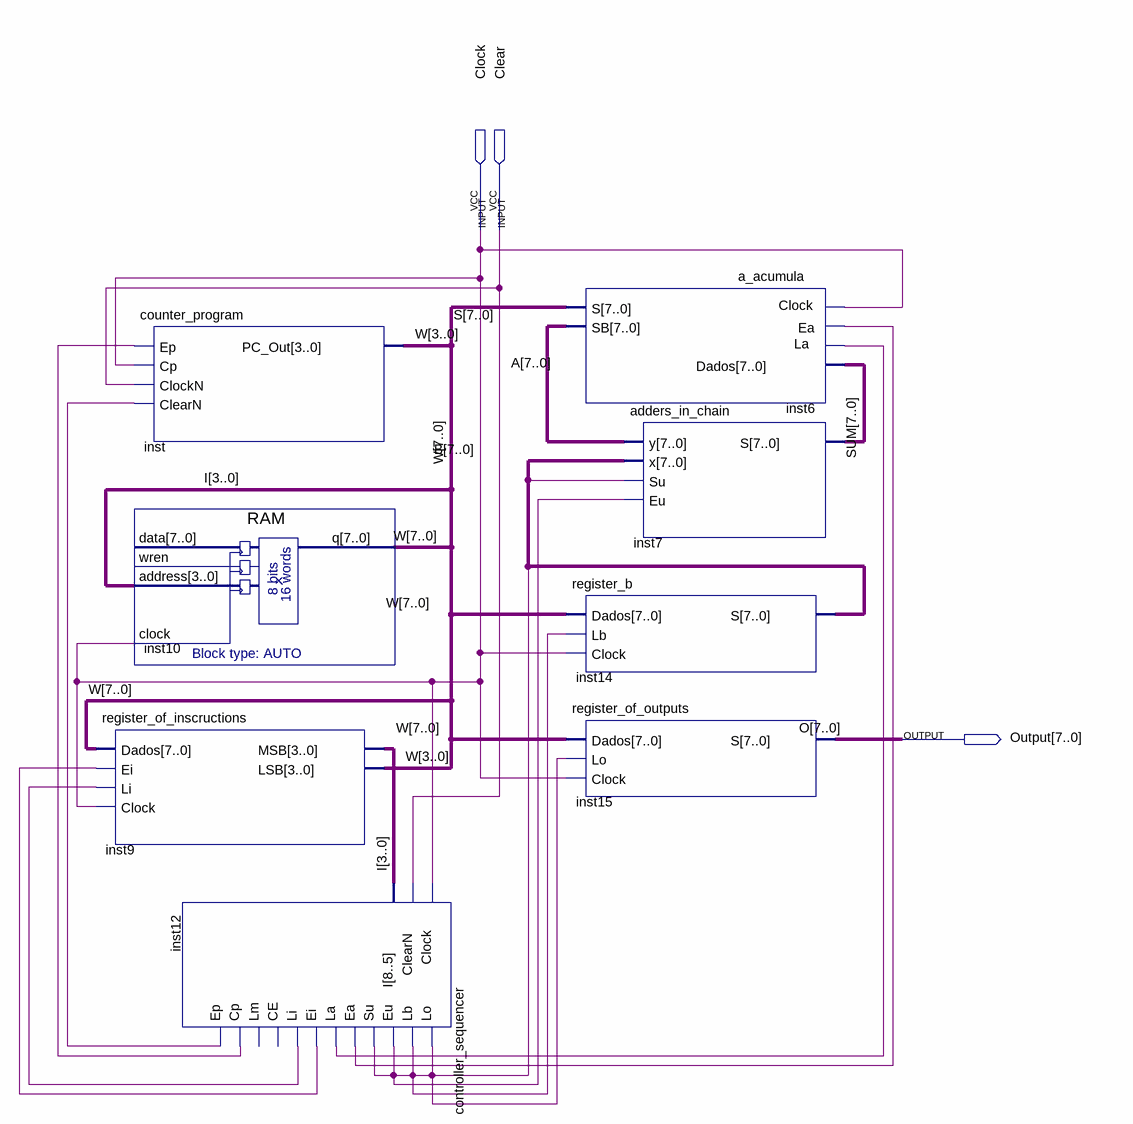
[diagram p0: schematic sheet]
// Quartus schematic m_computer.bdf as structural Verilog: 8 symbols, 3 pins
module m_computer (
  input  Clock,
  input  Clear,
  output [7:0] Output
);

  wire inst12_cp, inst12_ea, inst12_ei, inst12_ep, inst12_la, inst12_li, inst12_lo, undriven;
  wire [3:0] I;
  wire [7:0] A, B, S, SUM, W;

  counter_program inst (.Ep(inst12_cp), .Cp(Clock), .ClockN(Clear), .ClearN(inst12_ep), .PC_Out(W[3:0]));
  RAM inst10 (.address(I), .clock(Clock), .q(W));  // open: data, wren
  register_of_inscructions inst9 (.Dados(W), .Ei(inst12_ei), .Li(inst12_li), .Clock(Clock), .MSB(I), .LSB(W[3:0]));
  controller_sequencer inst12 (
    .Clock(Clock), .ClearN(Clear), .I(I), .Lo(inst12_lo), .Lb(inst12_lo), .Eu(inst12_lo), .Su(inst12_lo),
    .Ea(inst12_ea), .La(inst12_la), .Ei(inst12_ei), .Li(inst12_li), .Cp(inst12_cp), .Ep(inst12_ep));  // open: CE, Lm
  a_acumula inst6 (.La(Clock), .Ea(inst12_ea), .Clock(inst12_la), .Dados(SUM), .S(S), .SB(A));
  register_b inst14 (.Dados(W), .Lb(inst12_lo), .Clock(Clock), .S(B));
  register_of_outputs inst15 (.Dados(W), .Lo(inst12_lo), .Clock(Clock), .S(Output));
  adders_in_chain inst7 (.y(A), .x(B), .Su(undriven), .Eu(inst12_lo), .S(SUM));

  // Other names for the same wires on the sheet: O[7:0] = Output
endmodule
